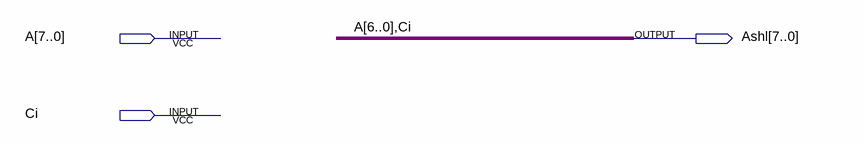
[diagram p0: schematic sheet]
// Quartus schematic SHL8.bdf as structural Verilog: 0 symbols, 3 pins
module SHL8 (
  input  [7:0] A,
  input  Ci,
  output [7:0] Ashl
);


  assign Ashl = {A[6:0], Ci};
endmodule
